# Altium schematic sheet Mechanical.SchDoc
size A; CompanyName: Microchip Technology Inc.; Organization: Microchip Technology; Address1: 2355 West Chandler Blvd.; Address2: Chandler, AZ  85224; Address4: USA; DocumentNumber: 5; SheetNumber: 5; SheetTotal: 5; SheetTitle: Mechanical; Time: Time
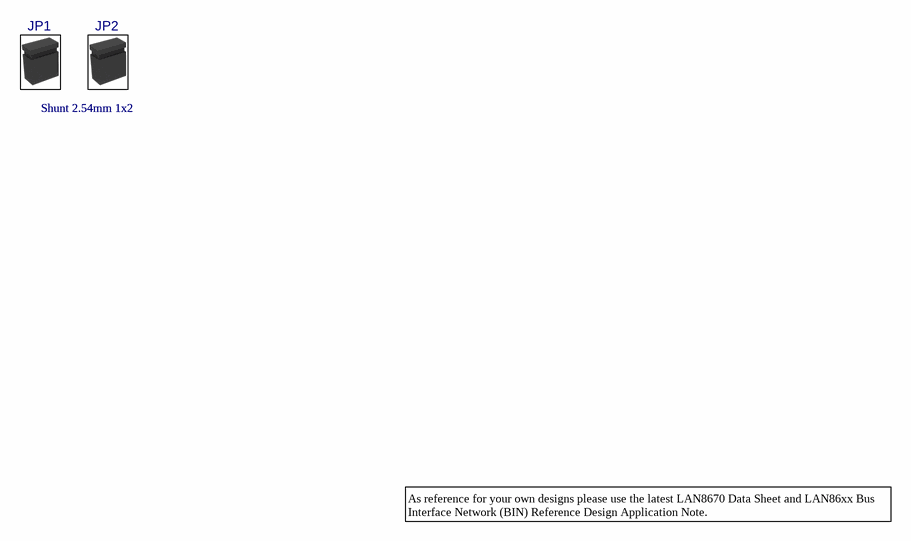
[diagram p0: Mechanical.SchDoc]

## Parts
JP1  value Shunt 2.54mm 1x2  (hidden comment: Jumper Mechanical Closed Top)  (mechanical)
JP2  value Shunt 2.54mm 1x2  (hidden comment: Jumper Mechanical Closed Top)  (mechanical)

## Notes on the sheet
- As reference for your own designs please use the latest LAN8670 Data Sheet and LAN86xx Bus Interface Network (BIN) Reference Design Application Note.
- Project Owner:
- PCB Layout Contact:
- PartNumber:
- Project Title
- Variant:
- Sheet Title
- Size
- A
- SCH #:
- PCB #:
- Rev:
- Date:
- Sheet
- Designed with
- Altium.com <http://go.altium.com/MicrochipLandingPage_Evaluation.html>
- File:

## Library data of the parts
JP1 JP2 = HW1016: Jumper Shorting; Manufacturer 1: Sullins Connector Solutions; Manufacturer Part Number 1: SSC02SYAN; MCHP-ID: HW1016; Description_: MECH HW JUMPER 2.54mm 1x2 GOLD CLOSED TOP; Dev Tools Status: Design; Owner: Lori Graham; Populated: MECH; Revision: 1; Symbol: Jumper Mechanical Closed Top; Status: MCL Design; ComponentLink1URL: https://chn-vm-apps.microchip.com/mchprepo/parts/Datasheets/S_C02SYAN.pdf; ComponentLink1Description: SVN Datasheet; ComponentLink2URL: C:\ALTIUM_WORK\00001_MCHP-CDB\Datasheets\S_C02SYAN.pdf; ComponentLink2Description: Local Datasheet; ComponentLink3URL: C:\ALTIUM_WORK\00001_MCHP-CDB\Library\LibraryRefs\Jumper Mechanical Closed Top.SchLib; ComponentLink3Description: Open Symbol; ComponentLink4Description: Open Footprint; ComponentLink5Description: Open Footprint 2; ComponentLink6Description: Open Footprint 3; ComponentLink7Description: Open Footprint 4; Type: Jumper; Category: Hardware; Supplier 1: Digi-Key; Supplier Part Number 1: S9002-ND; Quantity Override: 1